# EAGLE schematic Connector board (EAGLE 7.4.0)
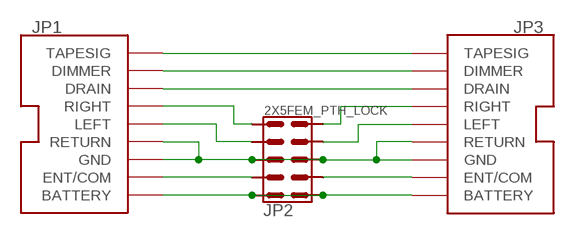
[diagram p0: schematic, sheet 1]

## Parts
JP1  CASSETTEPLUG  [9WAYMICROPACK100]
JP2  2X5FEM_PTH_LOCK  [2X5PTHFEMLOCK]
JP3  CASSETTEPLUGSTRAIGHT  [9PINCONNECTOR]

## Nets
GND: JP1.GND JP1.P$10(GND) JP1.P$11(GND) JP1.RETURN JP2.P$3 JP2.P$8 JP3.GND JP3.RETURN
N$1: JP2.P$9 JP3.ENT/COM
N$4: JP1.LEFT JP2.P$4
N$5: JP1.RIGHT JP2.P$5
N$6: JP1.DRAIN JP3.DRAIN
N$7: JP1.DIMMER JP3.DIMMER
N$8: JP1.TAPESIG JP3.TAPESIG
N$9: JP1.BATTERY JP2.P$1 JP2.P$10 JP3.BATTERY
N$10: JP1.ENT/COM JP2.P$2
N$11: JP2.P$7 JP3.LEFT
N$12: JP2.P$6 JP3.RIGHT

## Library data of the parts
JP1 JP3 = GM cassette faker:CASSETTEPLUG
JP2 = Jordan Connectors:2X5